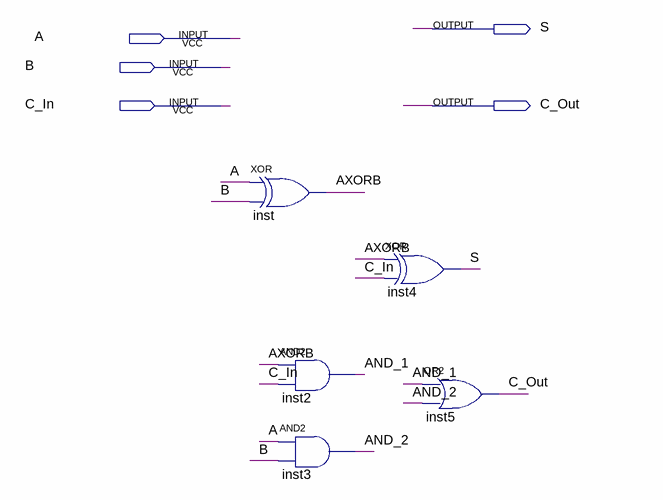
[diagram p0: schematic sheet]
// Quartus schematic FA.bdf as structural Verilog: 5 symbols, 5 pins
module FA (
  input  A,
  input  B,
  input  C_In,
  output S,
  output C_Out
);

  wire AND_1, AND_2, AXORB;

  xor inst (AXORB, A, B);
  and inst2 (AND_1, AXORB, C_In);
  and inst3 (AND_2, A, B);
  xor inst4 (S, AXORB, C_In);
  or inst5 (C_Out, AND_1, AND_2);
endmodule
